# Altium project TIA_For_Photodiode.PrjPcb
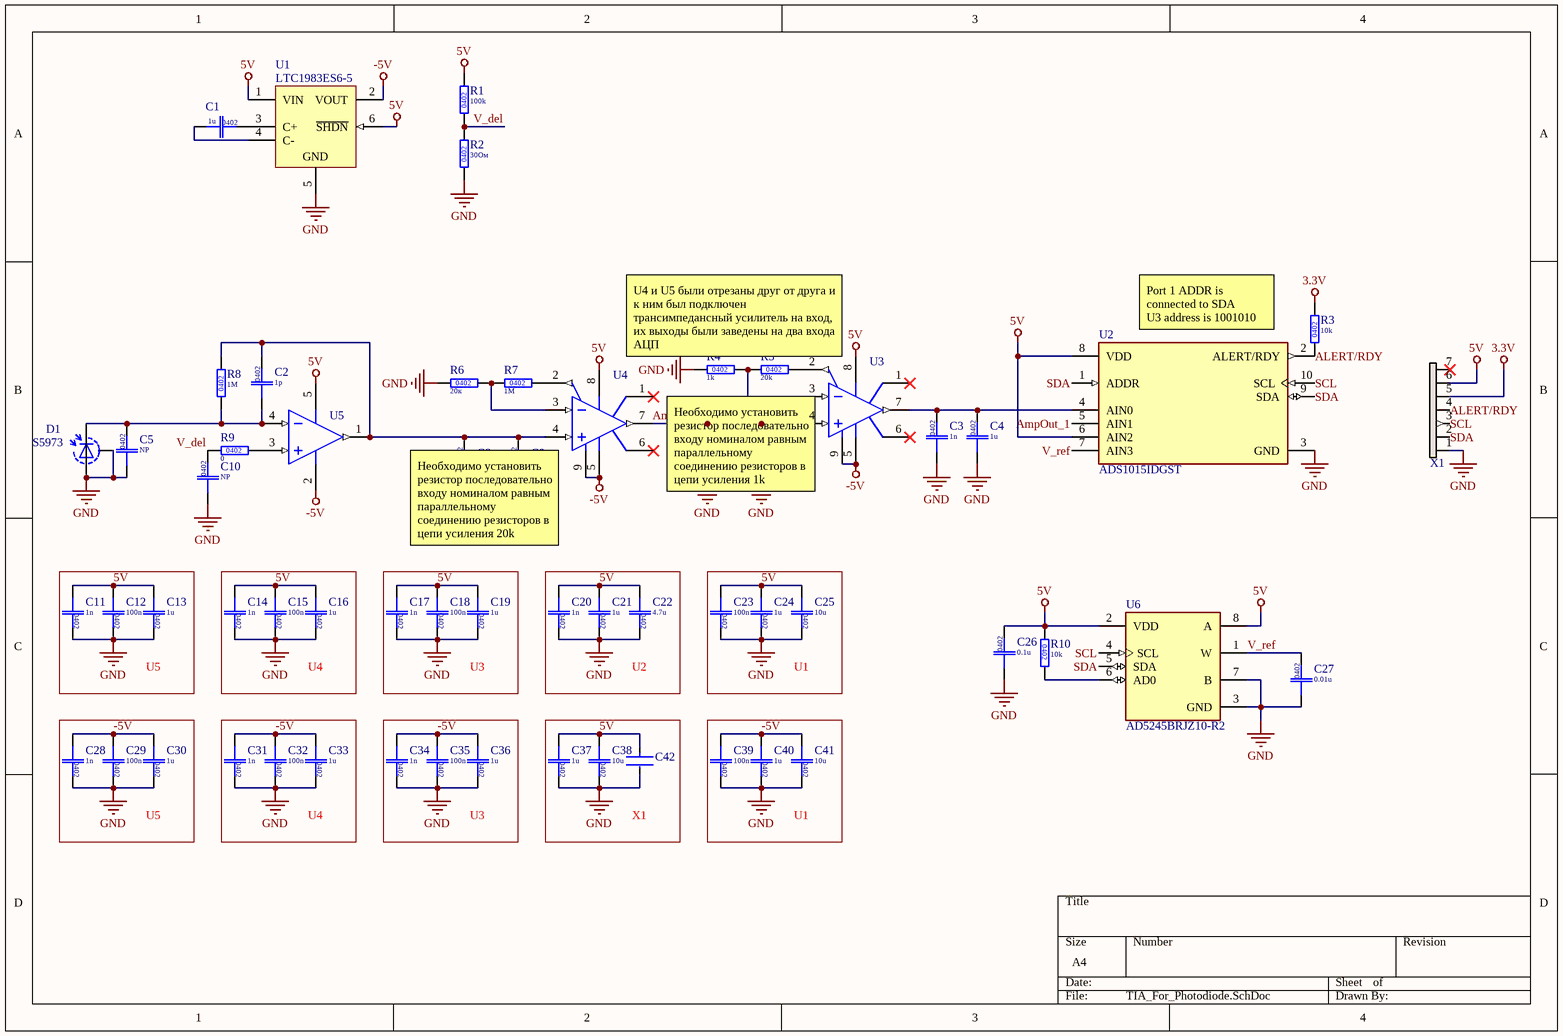
[diagram p0: TIA_For_Photodiode.SchDoc]
1 sheet, 60 parts. Net scope: global (net labels, ports and power ports of the same name join across sheets).
Board file: TIA_For_Photodiode.PcbDoc

## Sheet TIA_For_Photodiode.SchDoc
size A4; SheetNumber: 1; SheetTotal: 1

### Parts
C1  1u  [SMD 0402]
C2  1p  [SMD 0402]
C3  1n  [SMD 0402]
C4  1u  [SMD 0402]
C5  NP  [SMD 0402]
C6  1n  [SMD 0402]
C7  1u  [SMD 0402]
C8  1n  [SMD 0402]
C9  1u  [SMD 0402]
C10  NP  [SMD 0402]
C11  1n  [SMD 0402]
C12  100n  [SMD 0402]
C13  1u  [SMD 0402]
C14  1n  [SMD 0402]
C15  100n  [SMD 0402]
C16  1u  [SMD 0402]
C17  1n  [SMD 0402]
C18  100n  [SMD 0402]
C19  1u  [SMD 0402]
C20  1n  [SMD 0402]
C21  1u  [SMD 0402]
C22  4.7u  [SMD 0402]
C23  100n  [SMD 0402]
C24  1u  [SMD 0402]
C25  10u  [SMD 0402]
C26  0.1u  [SMD 0402]
C27  0.01u  [SMD 0402]
C28  1n  [SMD 0402]
C29  100n  [SMD 0402]
C30  1u  [SMD 0402]
C31  1n  [SMD 0402]
C32  100n  [SMD 0402]
C33  1u  [SMD 0402]
C34  1n  [SMD 0402]
C35  100n  [SMD 0402]
C36  1u  [SMD 0402]
C37  1u  [SMD 0402]
C38  10u  [SMD 0402]
C39  100n  [SMD 0402]
C40  1u  [SMD 0402]
C41  10u  [SMD 0402]
C42  GRM32ER60J107ME20L  [FP-GRM32-0_3-MFG]  (value not drawn)
D1  S5973  [TO-18]
R1  100k  [SMD 0402]
R2  30Ом  [SMD 0402]
R3  10k  [SMD 0402]
R4  1k  [SMD 0402]
R5  20k  [SMD 0402]
R6  20к  [SMD 0402]
R7  1М  [SMD 0402]
R8  1М  [SMD 0402]
R9  0  [SMD 0402]
R10  10k  [SMD 0402]
U1  LTC1983ES6-5  [LT-S6-6-TSOT-23_M]
U2  ADS1015IDGST  [FP-DGS0010A-MFG]
U3  AD8045ACPZ-REEL7  [ADI-CP-8-2_N]  (value not drawn)
U4  AD8045ACPZ-REEL7  [ADI-CP-8-2_N]  (value not drawn)
U5  AD8065ARTZ-REEL7  [ADI-RJ-5_L]  (value not drawn)
U6  AD5245BRJZ10-R2  [FP-RJ-8-IPC_C]
X1  PicoBlade 7 pins  [PicoBlade 7 pins]  (value not drawn)

### Blocks framed on the sheet
U5: C11-C13
U4: C14-C16
U3: C17-C19
U2: C20-C22
U1: C23-C25
U5: C28-C30
U4: C31-C33
U3: C34-C36
X1: C37 C38 C42
U1: C39-C41

### Nets
3.3V: R3.2 X1.5
5V: C11.1 C12.1 C13.1 C14.1 C15.1 C16.1 C17.1 C18.1 C19.1 C20.1 C21.1 C22.1 C23.1 C24.1 C25.1 C26.2 C37.1 C38.1 C42.1 R1.2 R10.1 U1.1(VIN) U1.6(~{SHDN}) U2.6(AIN2) U2.8(VDD) U3.8(+VS) U4.8(+VS) U5.5(+VS) U6.2(VDD) U6.8(A) X1.6
-5V: C28.1 C29.1 C30.1 C31.1 C32.1 C33.1 C34.1 C35.1 C36.1 C39.1 C40.1 C41.1 U1.2(VOUT) U3.5(-VS) U3.9(EP) U4.5(-VS) U4.9(EP) U5.2(-VS)
GND: C3.1 C4.1 C5.1 C6.1 C7.1 C8.1 C9.1 C10.1 C11.2 C12.2 C13.2 C14.2 C15.2 C16.2 C17.2 C18.2 C19.2 C20.2 C21.2 C22.2 C23.2 C24.2 C25.2 C26.1 C27.1 C28.2 C29.2 C30.2 C31.2 C32.2 C33.2 C34.2 C35.2 C36.2 C37.2 C38.2 C39.2 C40.2 C41.2 C42.2 D1.2(S) D1.3(A) R2.1 R4.1 R6.1 U1.5(GND) U2.3(GND) U6.3(GND) U6.7(B) X1.1
ALERT/RDY: R3.1 U2.2(ALERT/RDY) X1.4
AmpOut_1: C6.2 C7.2 U2.5(AIN1) U3.4(+IN) U4.7(OUT)
SCL: U2.10(SCL) U6.4(SCL) X1.3
SDA: U2.1(ADDR) U2.9(SDA) U6.5(SDA) X1.2
V_del: C10.2 R1.1 R2.2 R9.1
V_ref: C27.2 U2.7(AIN3) U6.1(W)
NetC1_1: C1.1 U1.4(C-)
NetC1_2: C1.2 U1.3(C+)
NetC2_1: C2.1 C5.2 D1.1(C) R8.1 U5.4(-IN)
NetC2_2: C2.2 C8.2 C9.2 R8.2 U4.4(+IN) U5.1(VOUT)
NetC3_2: C3.2 C4.2 U2.4(AIN0) U3.7(OUT)
NetR4_2: R4.2 R5.1 U3.3(-IN)
NetR5_2: R5.2 U3.2(FEEDBACK)
NetR6_2: R6.2 R7.1 U4.3(-IN)
NetR7_2: R7.2 U4.2(FEEDBACK)
NetR9_2: R9.2 U5.3(+IN)
NetR10_2: R10.2 U6.6(AD0)

Not connected (* = marked no-connect by the designer): U3 1(NC)* 6(NC)*; U4 1(NC)* 6(NC)*; X1 7*

### Notes on the sheet
- U4 и U5 были отрезаны друг от друга и к ним был подключен трансимпедансный усилитель на вход, их выходы были заведены на два входа АЦП
- Port 1 ADDR is connected to SDA
  U3 address is 1001010
- Необходимо установить резистор последовательно входу номиналом равным параллельному соединению резисторов в цепи усиления 1k
- Необходимо установить резистор последовательно входу номиналом равным параллельному соединению резисторов в цепи усиления 20k
- (in symbol Capacitor 0402 0,047u X7R 10% 25v) 0402
- (in symbol Capacitor 0402 4.7u X5R 20% 6,3v) 0402
- (in symbol Resistor 0402 11k 1%) 0402

### Library data of the parts
C1 = Capacitor 0402 0,047u X7R 10% 25v: Type: X7R; Tolerance: 10%; Voltage: 25v; Value: 1u; Part Name: Capacitor 0402 0,047u X7R 10% 25v; Link: https://www.chipdip.ru/product/grm155r71e473k
C2-C41 = Capacitor 0402 4.7u X5R 20% 6,3v: Type: X5R; Tolerance: 20%; Voltage: 6,3v; Part Name: Capacitor 0402 4.7u X5R 20% 6,3v; Link: https://www.chipdip.ru/product0/9000349068
  C2: Value: 1p
  C3 C6 C8 C11 C14 C17 C20 C28 C31 C34: Value: 1n
  C4 C7 C9 C13 C16 C19 C21 C24 C30 C33 C36 C37 C40: Value: 1u
  C5 C10: Value: NP
  C12 C15 C18 C23 C29 C32 C35 C39: Value: 100n
  C22: Value: 4.7u
  C25 C38 C41: Value: 10u
  C26: Value: 0.1u
  C27: Value: 0.01u
C42 = CMP-2000-05259-2: CAP CER 100UF 6.3V X5R 1210; 3DS Part Number: 220-00002; Manufacturer: Murata; Temperature Coefficient: 15%; Material: Ceramic; Tolerance: 20%; Octopart: https://octopart.com/grm32er60j107me20l-murata-197007; ComponentLink2URL: https://search.murata.co.jp/Ceramy/image/img/A01X/G101/ENG/GRM32ER60J107ME20-01.pdf; Temperature Range High: +85°C; RoHS: TRUE; Device Class L3: Ceramic Capacitors; Manufacturer Part Number: GRM32ER60J107ME20L; Device Class L2: Capacitors; Voltage: 6.3V; Package: GRM32-0.3; Voltage Rating: 6.3V; Category: Cap; Device Class L1: Passive Components; Temperature Characteristic: X5R; Automotive: No; Digikey Description: CAP CER 100UF 6.3V X5R 1210; Temperature: -55°C to +85°C; Height: 2.7mm; Ipc Land Pattern Name: CAPC320250X250; Capacitance: 100uF; Temperature Range Low: -55°C; Lead Free: Yes; Value: 100uF; ComponentLink2Description: Datasheet
D1 = S5973: Hamamatsu, S5973 IR + Visible Light Si PIN Photodiode, Through Hole TO-18
R1-R10 = Resistor 0402 11k 1%: Tolerance: 1%; Temperature Coefficient: 100ppm/°C; Power Rating: 0,062W; Part Name: Resistor 0402 11k 1%; Temperature: -55...+155°C; Link: https://www.chipdip.ru/product/0.062w-0402-11-kom-1
  R1: Value: 100k
  R2: Value: 30Ом
  R3 R10: Value: 10k
  R4: Value: 1k
  R5: Value: 20k
  R6: Value: 20к
  R7 R8: Value: 1М
  R9: Value: 0
U1 = CMP-0475-00349-1: 100 mA Regulated Charge-Pump Inverter, 5 to 5.5 V Vin, -5 V Vout, 6-pin SOT23 (S6-6), -40 to 85 degC; Manufacturer: Linear Technology; Ishutdown(uA): 0.1; Vin Max(V): 5.5; Voutput: -5 V; Vin Min(V): 5; Isupply(mA): 0.025; Frequency(kHz): 900; Max Iout(mA): 100; Code_JEDEC: MO-193; ComponentLink2Description: Datasheet; ComponentLink3Description: Package Specification; ComponentLink1URL: http://www.linear.com/; DatasheetVersion: Rev. A; RoHS: FALSE; PartNumber: LTC1983ES6-5; PackageVersion: Jun-10; PackageDescription: 6-Pin Plastic TSOT-23, Body 2.9 x 1.63 mm, Pitch 0.95 mm; ComponentLink3URL: http://cds.linear.com/docs/en/packaging/SOT_6_05-08-1636.pdf; Mounting Technology: Surface Mount; ComponentLink2URL: http://cds.linear.com/docs/en/datasheet/1983fa.pdf; ComponentLink1Description: Manufacturer URL; PackageReference: S6-6
U2 = CMP-0003-00377-3: IC ADC 12BIT SIGMA-DELTA 10VSSOP; Supply Type: Single; Number of Converters: 1; Number of Bits: 12; Number of Inputs: 4; Sampling Rate: 3.3KS/s; Conversion Rate: 3300S/s; Min Supply Voltage: 2V; Interface: I2C; Operating Supply Voltage: 3.3V; Polarity: Bipolar; Nominal Supply Current: 150uA; Integral Nonlinearity (INL): 0.5LSB; Max Power Dissipation: 900uW; Max Supply Voltage (DC): 5.5V; Resolution: 12b; Width: 3mm; Min Operating Temperature: -40°C; Contact Plating: Gold; Number of A/D Converters: 1; Max Operating Temperature: 125°C; Height: 1.02mm; Case/Package: VSSOP; Package Quantity: 250; Number of Elements: 1; Lead Free: Lead Free; Number of Pins: 10; Radiation Hardening: No; Termination: SMD/SMT; Length: 3mm; Min Supply Voltage (DC): 2V; Power Dissipation: 900uW; Number of Channels: 4; Max Supply Voltage: 5.5V; REACH SVHC: No SVHC; Packaging: Tape and Reel
U3 U4 = CMP-0384-00082-1: Single Channel Ultra Low Distortion  Operational Amplifier, 1 GHz BW, 1.35 KV/us SR, Industrial, 8-pin QFN (CP-8-2), Reel; Generic Part Number: AD8045; Manufacturer: Analog Devices; V Span Min: 3.3V; Input Bias Current: 2uA; Amplifiers Per Package: 1; Input Offset Voltage: 200uV; Small Signal Bandwidth: 1GHz; V Span Max: 12V; Iq/Amp: 19mA; ComponentLink3Description: Package Specification; ComponentLink1Description: Manufacturer URL; PackageReference: CP-8-2; ComponentLink2URL: http://www.analog.com/static/imported-files/data_sheets/AD8045.pdf; ComponentLink2Description: Datasheet; DatasheetVersion: Rev. A; ComponentLink3URL: http://www.analog.com/static/imported-files/packages/56953322593982CP_8_2.pdf; Slew Rate: 1.35KV/us; PartNumber: AD8045ACPZ-REEL7; Mounting Technology: Surface Mount; ComponentLink1URL: http://www.analog.com/en/index.html; PackageVersion: 061507-B; PackageDescription: 8-Pin Lead Frame Chip Scale Package, Body 3 x 3 mm, Pitch 0.5 mm
U5 = CMP-0384-01535-3: Single Channel Low Power Operational Amplifier, 145 MHz BW, 180 V/us SR, Industrial, 5-pin SOT23 (RJ-5), Reel; Generic Part Number: AD8065; Manufacturer: Analog Devices; Input Bias Current: 2pA; Amplifiers Per Package: 1; Input Offset Voltage: 400uV; Iq/Amp: 7.4mA; Automotive Qualified: Yes; Small Signal Bandwidth: 145MHz; V Span Min: 5V; V Span Max: 24V; DatasheetVersion: Rev. J; Code_JEDEC: MO-178-AA; RevisionNote: Reference Circuit URL fixed; PackageReference: RJ-5; PackageVersion: 121608-A; PartNumber: AD8065ARTZ-REEL7; ComponentLink2URL: http://www.analog.com/static/imported-files/data_sheets/AD8065_8066.pdf; ComponentLink3URL: http://www.analog.com/static/imported-files/packages/PKG_PDF/SOT-23(RJ)/RJ_5.pdf; ComponentLink2Description: Datasheet; ComponentLink1URL: http://www.analog.com/en/index.html; PackageDescription: 5-Pin Small Outline Transistor Package, Body 2.9 x 1.6 mm, Pitch 0.95 mm; Slew Rate: 180V/us; ComponentLink4URL: http://www.analog.com/en/all-operational-amplifiers-op-amps/operational-amplifiers-op-amps/ad8065/products/product.html#product-recommendations; ComponentLink3Description: Package Specification; Mounting Technology: Surface Mount; ComponentLink1Description: Manufacturer URL; ComponentLink4Description: Reference Circuit
U6 = CMP-09083-000005-1: IC DGT POT 10KOHM 256TAP SOT23-8; Manufacturer: Analog Devices; Interface: I2C; Nominal Resistance: 10kΩ; Nominal Supply Current: 3uA; Tolerance: 30%; Max Junction Temp: +150°C; Standoff Height: 0.05mm; Number Of Taps: 256; Number Of Circuits: 1; Min Supply Voltage: 2.7V; Max Supply Voltage: 5.5V; Temperature Coefficient: 45ppm/°C; Footprint Url: https://www.analog.com/media/en/package-pcb-resources/package/pkg_pdf/sot-23rj/RJ_8.pdf; Height: 1.45mm; Temperature Range Low: -40°C; Category: IC; Temperature: -40°C to +125°C; ComponentLink2URL: https://www.analog.com/media/en/technical-documentation/data-sheets/AD5245.pdf; Automotive: No; Lead Free: Yes; ComponentLink2Description: Datasheet; Device Class L2: Data Converter ICs; Digikey Description: IC DGT POT 10KOHM 256TAP SOT23-8; Manufacturer Part Number: AD5245BRJZ10-R2; Package: RJ-8; Octopart: https://octopart.com/ad5245brjz10-r2-analog+devices-446714; Ipc Land Pattern Name: SOT65P280X120-8; Device Class L1: Integrated Circuits (ICs); RoHS: TRUE; Temperature Range High: +125°C; Device Class L3: Digital Potentiometers; Mouser Description: Digital Potentiometer ICs IC 256-pos I2C